# Altium schematic sheet EEPROM.SchDoc
size 241 x 127 mm; SheetNumber: 0; SheetTotal: 0
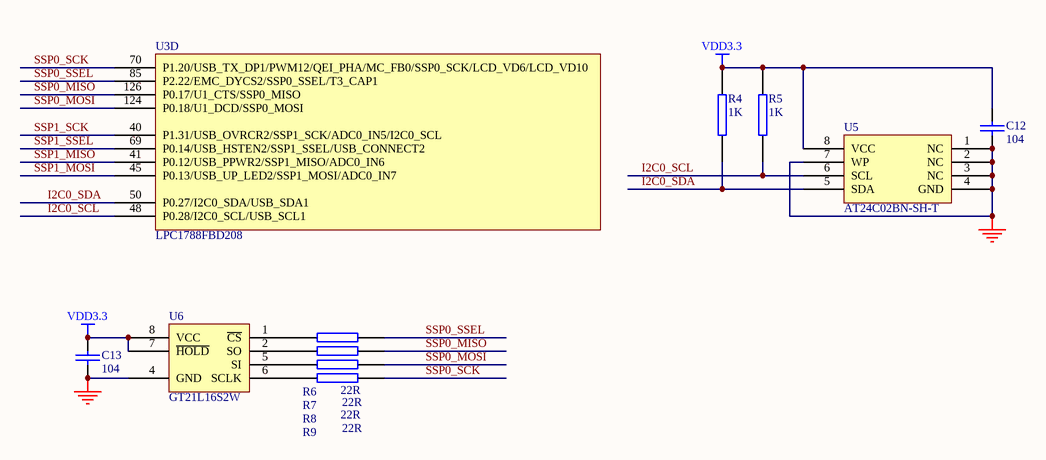
[diagram p0: EEPROM.SchDoc]

## Parts
C12  104  [C0603]
C13  104  [C0603]
R4  1K  [R0603]
R5  1K  [R0603]
R6  22R  [R0603]
R7  22R  [R0603]
R8  22R  [R0603]
R9  22R  [R0603]
U3  LPC1788FBD208  [QFP208]  (part D of 8)
U5  AT24C02BN-SH-T  [SOP8]
U6  GT21L16S2W  [SOP8]

## Nets
GND: C12.2 C13.2 U5.1(NC) U5.2(NC) U5.3(NC) U5.4(GND) U5.7(WP) U6.4(GND)
NC: U6.3(NC)
VDD3.3: C12.1 C13.1 R4.2 R5.2 U5.8(VCC) U6.7(~{HOLD}) U6.8(VCC)
I2C0_SCL: R5.1 U3.48(P0.28/I2C0_SCL/USB_SCL1) U5.6(SCL)
I2C0_SDA: R4.1 U3.50(P0.27/I2C0_SDA/USB_SDA1) U5.5(SDA)
SSP0_MISO: R7.2 U3.126(P0.17/U1_CTS/SSP0_MISO)
SSP0_MOSI: R8.2 U3.124(P0.18/U1_DCD/SSP0_MOSI)
SSP0_SCK: R9.2 U3.70(P1.20/USB_TX_DP1/PWM12/QEI_PHA/MC_FB0/SSP0_SCK/LCD_VD6/LCD_VD10)
SSP0_SSEL: R6.2 U3.85(P2.22/EMC_DYCS2/SSP0_SSEL/T3_CAP1)
SSP1_MISO: U3.41(P0.12/USB_PPWR2/SSP1_MISO/ADC0_IN6)
SSP1_MOSI: U3.45(P0.13/USB_UP_LED2/SSP1_MOSI/ADC0_IN7)
SSP1_SCK: U3.40(P1.31/USB_OVRCR2/SSP1_SCK/ADC0_IN5/I2C0_SCL)
SSP1_SSEL: U3.69(P0.14/USB_HSTEN2/SSP1_SSEL/USB_CONNECT2)
NetR6_1: R6.1 U6.1(~{CS})
NetR7_1: R7.1 U6.2(SO)
NetR8_1: R8.1 U6.5(SI)
NetR9_1: R9.1 U6.6(SCLK)

## Library data of the parts
C12 C13 = CAP: Capacitor
R4-R9 = RES2
U5 = AT24C02
U6 = GT21L16T1W